# EAGLE design 6pil-2motor-1back (EAGLE 9.6.2)
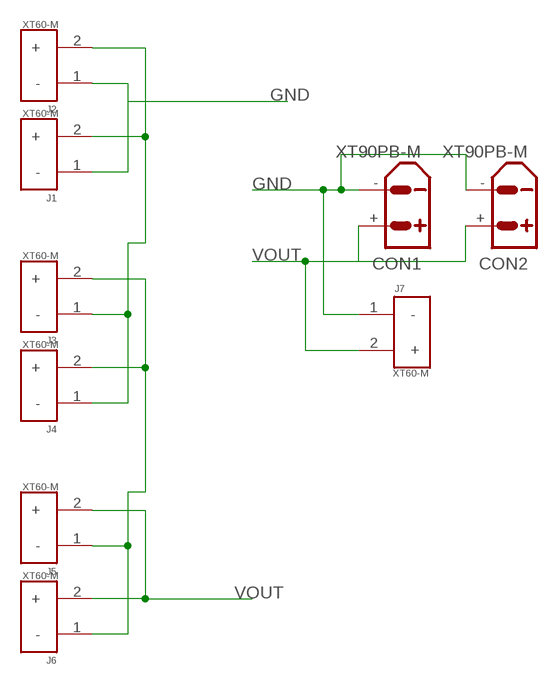
[diagram p0: schematic, sheet 1]

## Parts
CON1  XT90PB-M  [XT90PB-M]
CON2  XT90PB-M  [XT90PB-M]
J1  XT60-M  [AMASS_XT60-M]
J2  XT60-M  [AMASS_XT60-M]
J3  XT60-M  [AMASS_XT60-M]
J4  XT60-M  [AMASS_XT60-M]
J5  XT60-M  [AMASS_XT60-M]
J6  XT60-M  [AMASS_XT60-M]
J7  XT60-M  [AMASS_XT60-M]

## Nets
GND: CON1.- CON2.- J1.1(-) J2.1(-) J7.1(-)
N$2: J1.2(+) J2.2(+) J3.1(-) J4.1(-)
N$3: J3.2(+) J4.2(+) J5.1(-) J6.1(-)
VOUT: CON1.+ CON2.+ J5.2(+) J6.2(+) J7.2(+)

## Library data of the parts
CON1 CON2 = amass:XT90: AMASS XT90 connector Store in Japan AMASS XT90 connector <https://szc.jp/ams-xt90>
J1-J7 = XT60-M:XT60-M: DC supply; XT60; male; PIN:2; for cable; soldered; 60A; 500V; AVAILABILITY: Unavailable; DESCRIPTION: Plug; DC supply; XT60; male; PIN: 2; for cable; soldered; 30A; 500V; MF: AMASS; MP: XT60-M; PACKAGE: Package; PRICE: None

## Board
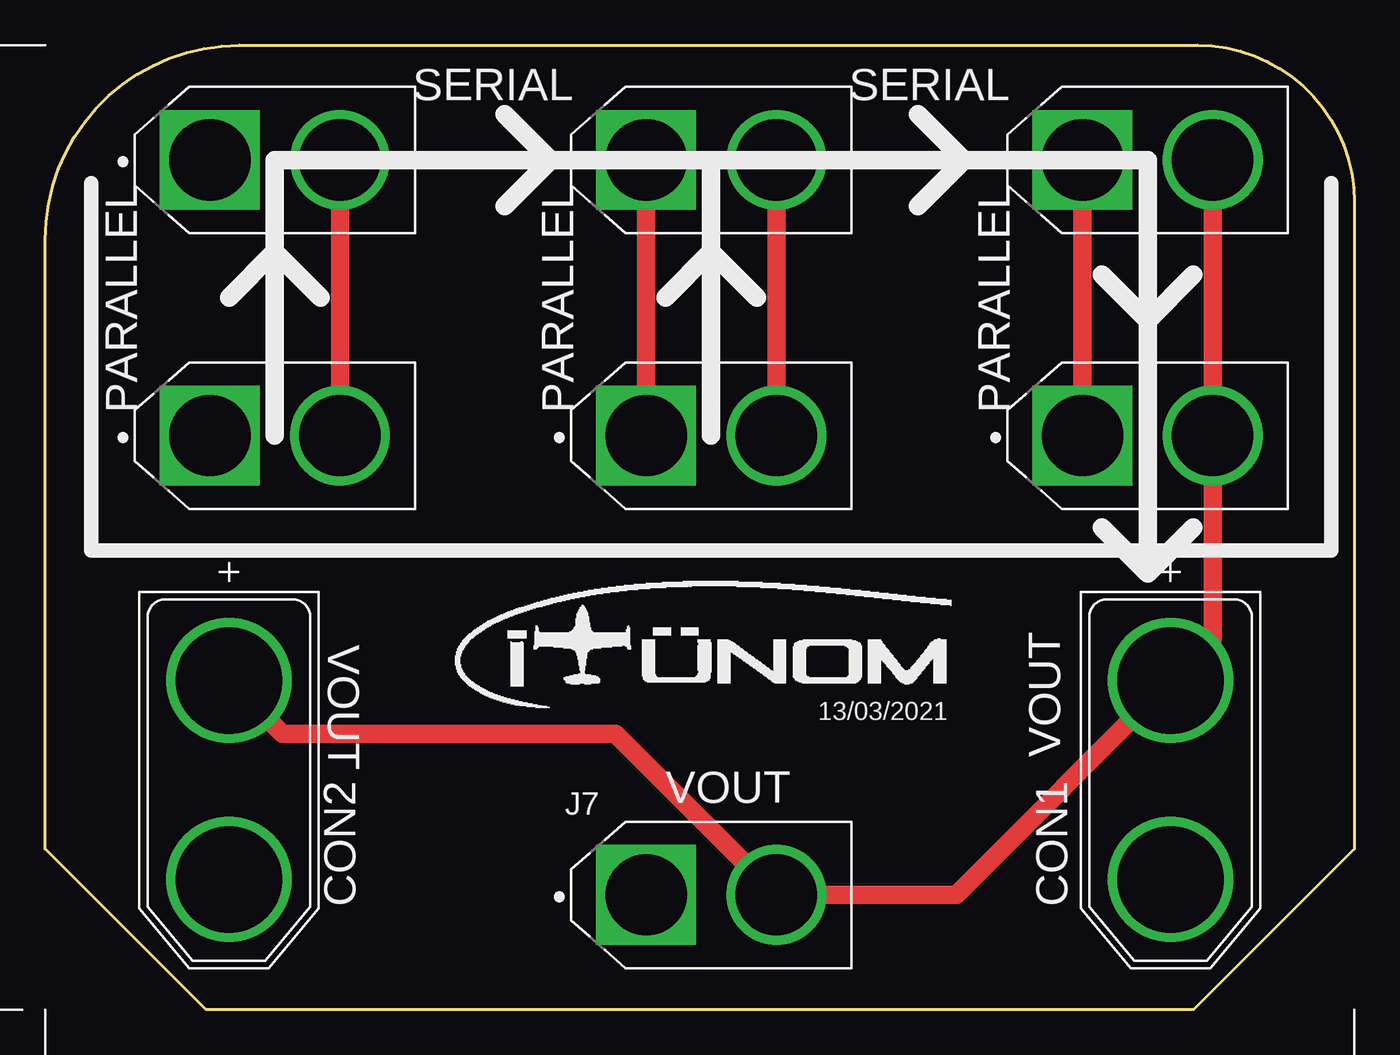
[diagram p1: board, top side]
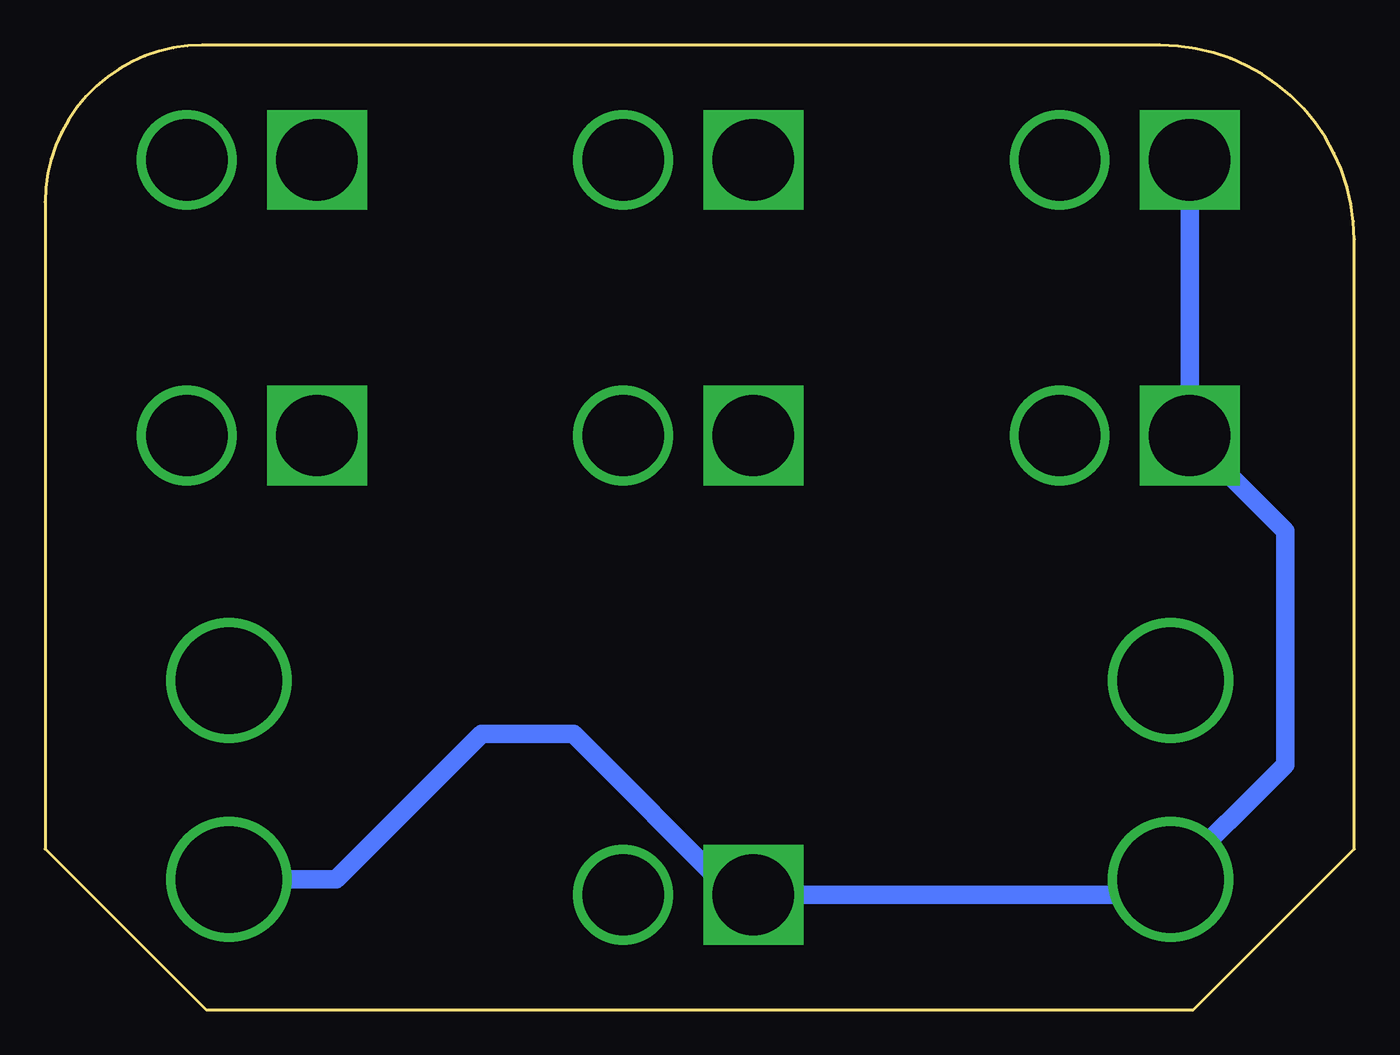
[diagram p2: board, bottom side, seen from below]

Size 72.39 x 53.34 mm. Coordinates in mm from the lower left corner, seen from the top.
Outline: 0,8.89 0,42.59 arc-90 10.75,53.34 63.72,53.34 arc-90 72.39,44.67 72.39,8.89 63.5,0 8.89,0 0,8.89
Copper layers (1*16): Top 0.035mm / dielectric 1.5mm / Bottom 0.035mm
Design rules "default": minimum track width 6mil, minimum drill 0.35mm, track to track 6mil, track to pad 6mil, pad to pad 6mil, via to via 6mil, smd to smd 6mil, copper to edge 40mil, drill to drill 6mil, minimum pad ring 10mil, minimum via ring 8mil, stop-mask expansion 4mil, vias tented up to drill 0mil, thermal gap 10mil

### Footprints (pad centres in the part's own frame; a part is rotated, then mirrored left to right if it is on the bottom)
XT90PB-M = drill 5.9: + 5.5,0; - -5.5,0
AMASS_XT60-M = drill 4.5 square: 1 -3.6,0 | drill 4.5: 2 3.6,0

### Placement (x,y rotation side)
CON1  62.23,12.7 90 top
CON2  10.16,12.7 90 top
J1  12.7,46.99 0 top
J2  12.7,31.75 0 top
J3  36.83,31.75 0 top
J4  36.83,46.99 0 top
J5  60.96,46.99 0 top
J6  60.96,31.75 0 top
J7  36.83,6.35 0 top

### Tracks (layer width: path | path; a pad name or v marks a point on that pad's centre or on a via)
GND
  Bottom 1.016: J1.1 J2.1 3.81,26.46 3.81,13.55 CON2.- 11.01,6.35 J7.1 34.29,6.35 43.18,15.24 48.26,15.24 56.3,7.2 CON1.-
N$2
  Top 1.016: J2.2 J1.2 J4.1 J3.1
N$3
  Top 1.016: J3.2 J4.2 J5.1 J6.1
VOUT
  Top 1.016: J5.2 J6.2 64.56,20.53 CON1.+ 50.38,6.35 J7.2 31.54,15.24 13.12,15.24 CON2.+

### Text on the board
tNames: SERIAL | SERIAL | PARALLEL | PARALLEL | PARALLEL | VOUT | 13/03/2021 | VOUT | VOUT